# Altium project PCB_Project.PrjPcb
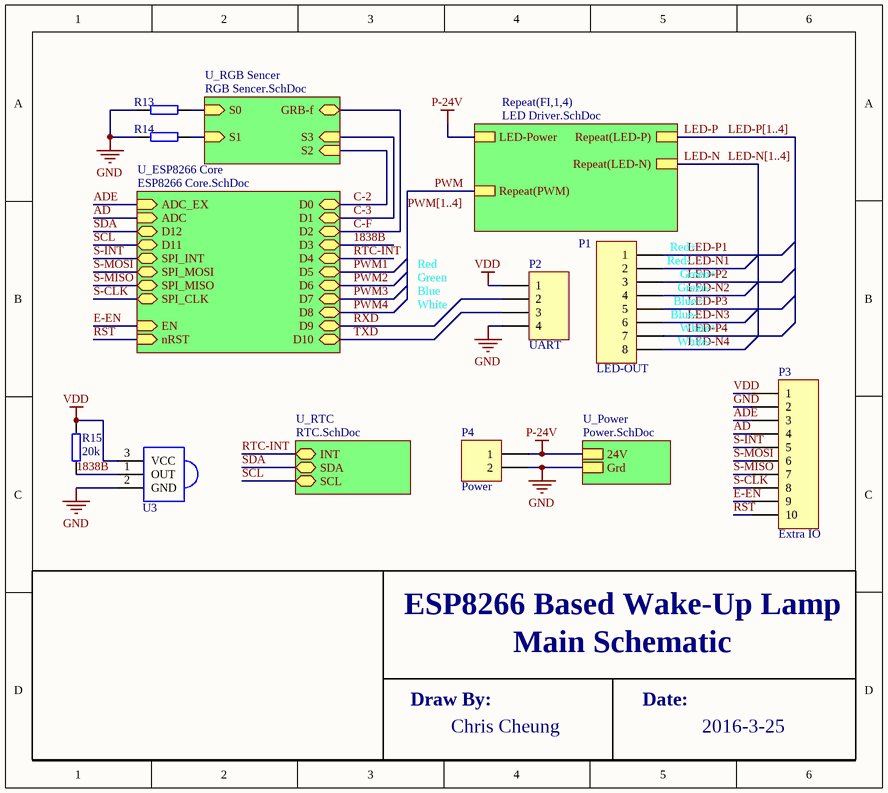
[diagram p0: Main.SchDoc]
6 sheets, 75 parts. Net scope: hierarchical (ports join the sheet entries above them; power ports are global).
Sheets:
  Main.SchDoc
    U_ESP8266 Core = ESP8266 Core.SchDoc
    U_Power = Power.SchDoc
    FI1 = LED Driver.SchDoc
    FI2 = LED Driver.SchDoc
    FI3 = LED Driver.SchDoc
    FI4 = LED Driver.SchDoc
    U_RGB Sencer = RGB Sencer.SchDoc
    U_RTC = RTC.SchDoc

## Sheet Main.SchDoc
size 165 x 147 mm

### Parts
P1  LED-OUT  [HDR1X8H]
P2  UART  [HDR1X4H]
P3  Extra IO  [HDR1X10H]
P4  Power  [HDR1X2]
R13  0Ohm  [SMT_R_0402]  (value not drawn)
R14  0Ohm  [SMT_R_0402]  (value not drawn)
R15  20k  [SMT_R_0402]
U3  Infrared In-VS1838  (value not drawn)

### Sub-sheets
Repeat(FI,1,4) = LED Driver.SchDoc: Repeat(LED-P), Repeat(LED-N), Repeat(PWM), LED-Power
U_ESP8266 Core = ESP8266 Core.SchDoc: D0 (bidir), D1 (bidir), D2 (bidir), D3 (bidir), D4 (bidir), D5 (bidir), D6 (bidir), D7 (bidir), D8 (bidir), D9 (bidir), D10 (bidir), D11 (bidir), D12 (bidir), SPI_INT (bidir), SPI_MOSI (bidir), SPI_MISO (bidir), SPI_CLK (bidir), nRST (in), ADC_EX (in), ADC (in), EN (in)
U_Power = Power.SchDoc: 24V, Grd
U_RGB Sencer = RGB Sencer.SchDoc: S0 (in), S1 (in), S2 (in), S3 (in), GRB-f (bidir)
U_RTC = RTC.SchDoc: INT (bidir), SDA (bidir), SCL (bidir)

### Nets
GND: P2.4 P3.2 P4.2 R13.1 R14.1 U3.2(GND) ; sheet U_Power/Grd
P-24V: P4.1 ; sheet U_Power/24V, sheet Repeat(FI,1,4)/LED-Power
VDD: P2.1 P3.1 R15.2 U3.3(VCC)
1838B: R15.1 U3.1(OUT) ; sheet U_ESP8266 Core/D3
AD: P3.4 ; sheet U_ESP8266 Core/ADC
ADE: P3.3 ; sheet U_ESP8266 Core/ADC_EX  [project net ADC_EX]
C-2: sheet U_ESP8266 Core/D0, sheet U_RGB Sencer/S2
C-3: sheet U_ESP8266 Core/D1, sheet U_RGB Sencer/S3
C-F: sheet U_ESP8266 Core/D2, sheet U_RGB Sencer/GRB-f
E-EN: P3.9 ; sheet U_ESP8266 Core/EN
LED-N: sheet Repeat(FI,1,4)/Repeat(LED-N)
LED-N1: P1.2
LED-N2: P1.4
LED-N3: P1.6
LED-N4: P1.8
LED-P: sheet Repeat(FI,1,4)/Repeat(LED-P)
LED-P1: P1.1
LED-P2: P1.3
LED-P3: P1.5
LED-P4: P1.7
PWM: sheet Repeat(FI,1,4)/Repeat(PWM)
RST: P3.10 ; sheet U_ESP8266 Core/nRST  [project net nRST]
RTC-INT: sheet U_ESP8266 Core/D4, sheet U_RTC/INT  [project net GPIO2]
RXD: P2.2 ; sheet U_ESP8266 Core/D9
S0: R13.2 ; sheet U_RGB Sencer/S0
S1: R14.2 ; sheet U_RGB Sencer/S1
S-CLK: P3.8 ; sheet U_ESP8266 Core/SPI_CLK
S-INT: P3.5 ; sheet U_ESP8266 Core/SPI_INT
S-MISO: P3.7 ; sheet U_ESP8266 Core/SPI_MISO
S-MOSI: P3.6 ; sheet U_ESP8266 Core/SPI_MOSI
SCL: sheet U_ESP8266 Core/D11, sheet U_RTC/SCL  [project net GPIO9]
SDA: sheet U_ESP8266 Core/D12, sheet U_RTC/SDA  [project net GPIO10]
TXD: P2.3 ; sheet U_ESP8266 Core/D10

### Buses and harness runs
bus LED-N[1..4]
bus LED-P[1..4]
bus PWM[1..4]

### Notes on the sheet
- Red
- (near P1) Red-
- (near P1) Red+
- (near P1) Green+
- Green
- Blue
- White
- (near P1) Blue-
- (near P1) Blue+
- (near P1) Green-
- (near P1) White+
- (near P1) White-
- ESP8266 Based Wake-Up Lamp
- Main Schematic
- Draw By:
- Chris Cheung
- Date:
- 2016-3-25

### Library data of the parts
P1 = Header 8H: Header, 8-Pin, Right Angle; LatestRevisionDate: 17-Jul-2002; LatestRevisionNote: Re-released for DXP Platform.; Publisher: Altium Limited
P2 = Header 4H: Header, 4-Pin, Right Angle; LatestRevisionDate: 17-Jul-2002; LatestRevisionNote: Re-released for DXP Platform.; Publisher: Altium Limited
P3 = Header 10H: Header, 10-Pin, Right Angle; LatestRevisionDate: 17-Jul-2002; LatestRevisionNote: Re-released for DXP Platform.; Publisher: Altium Limited
P4 = Header 2: Header, 2-Pin; LatestRevisionDate: 17-Jul-2002; LatestRevisionNote: Re-released for DXP Platform.; Publisher: Altium Limited
R13-R15 = SMT_R_0402: Surface mount resistor 0402
U3 = VS1838: Infrared In

## Sheet ESP8266 Core.SchDoc
size 165 x 190 mm
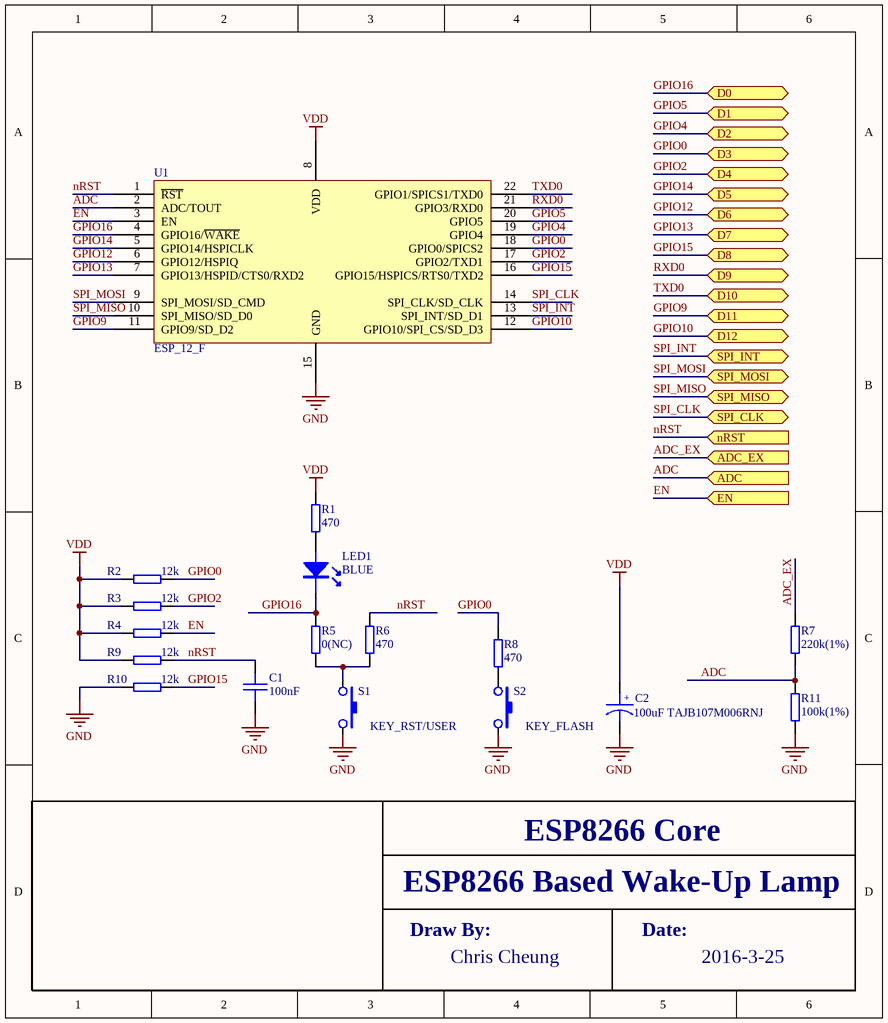
[diagram p1: ESP8266 Core.SchDoc]

### Parts
C1  100nF  [SMT_C_0402]
C2  100uF TAJB107M006RNJ  [SMT_C_Tantalum_B]
LED1  BLUE  [SMT_LED_0603]
R1  470  [SMT_R_0402]
R2  12k  [SMT_R_0402]
R3  12k  [SMT_R_0402]
R4  12k  [SMT_R_0402]
R5  0(NC)  [SMT_R_0402]
R6  470  [SMT_R_0402]
R7  220k(1%)  [SMT_R_0402]
R8  470  [SMT_R_0402]
R9  12k  [SMT_R_0402]
R10  12k  [SMT_R_0402]
R11  100k(1%)  [SMT_R_0402]
S1  KEY_RST/USER  [SMT_SW_PTS_820]
S2  KEY_FLASH  [SMT_SW_PTS_820]
U1  ESP_12_F  [ESP_12_E_L]

### Ports
ADC (in), ADC_EX (in), D0 (bidir), D1 (bidir), D2 (bidir), D3 (bidir), D4 (bidir), D5 (bidir), D6 (bidir), D7 (bidir), D8 (bidir), D9 (bidir), D10 (bidir), D11 (bidir), D12 (bidir), EN (in), nRST (in), SPI_CLK (bidir), SPI_INT (bidir), SPI_MISO (bidir), SPI_MOSI (bidir)

### Nets
GND: C1.2 C2.2 R10.1 R11.1 S1.2 S2.2 U1.15(GND)
VDD: C2.1 R1.2 R2.1 R3.1 R4.1 R9.1 U1.8(VDD)
ADC: R7.1 R11.2 U1.2(ADC/TOUT) ; port ADC  [project net AD]
ADC_EX: R7.2 ; port ADC_EX
EN: R4.2 U1.3(EN) ; port EN  [project net E-EN]
GPIO0: R2.2 R8.2 U1.18(GPIO0/SPICS2) ; port D3  [project net 1838B]
GPIO2: R3.2 U1.17(GPIO2/TXD1) ; port D4
GPIO4: U1.19(GPIO4) ; port D2  [project net C-F]
GPIO5: U1.20(GPIO5) ; port D1  [project net C-3]
GPIO9: U1.11(GPIO9/SD_D2) ; port D11
GPIO10: U1.12(GPIO10/SPI_CS/SD_D3) ; port D12
GPIO12: U1.6(GPIO12/HSPIQ) ; port D6
GPIO13: U1.7(GPIO13/HSPID/CTS0/RXD2) ; port D7
GPIO14: U1.5(GPIO14/HSPICLK) ; port D5
GPIO15: R10.2 U1.16(GPIO15/HSPICS/RTS0/TXD2) ; port D8
GPIO16: LED1.2(K) R5.2 U1.4(GPIO16/~{WAKE}) ; port D0  [project net C-2]
nRST: C1.1 R6.2 R9.2 U1.1(~{RST}) ; port nRST
RXD0: U1.21(GPIO3/RXD0) ; port D9  [project net RXD]
SPI_CLK: U1.14(SPI_CLK/SD_CLK) ; port SPI_CLK  [project net S-CLK]
SPI_INT: U1.13(SPI_INT/SD_D1) ; port SPI_INT  [project net S-INT]
SPI_MISO: U1.10(SPI_MISO/SD_D0) ; port SPI_MISO  [project net S-MISO]
SPI_MOSI: U1.9(SPI_MOSI/SD_CMD) ; port SPI_MOSI  [project net S-MOSI]
TXD0: U1.22(GPIO1/SPICS1/TXD0) ; port D10  [project net TXD]
NetLED1_1: LED1.1(A) R1.1
NetR5_1: R5.1 R6.1 S1.1
NetR8_1: R8.1 S2.1

### Notes on the sheet
- ESP8266 Based Wake-Up Lamp
- ESP8266 Core
- Draw By:
- Chris Cheung
- Date:
- 2016-3-25
- (in symbol SMT_C_Tantalum_B) +

### Library data of the parts
C1 = SMT_C_0402: Surface mount capacitor 0402
C2 = SMT_C_Tantalum_B: Capacitor, SM Tantalum; Body 3.5 x 2.8 mm (LxW typ)
LED1 = SMT_LED_0603: SMT LED
R1-R11 = SMT_R_0402: Surface mount resistor 0402
S1 S2 = SMT_SW_PTS_820: SMT Tactile ‎Switch PTS 820 Series
U1 = ESP_12_E: ESP-12 Wi-Fi Module by AI-Thinker; IC: ESP8266-EX; Vendor: Ai-thinker

## Sheet Power.SchDoc
size 165 x 127 mm
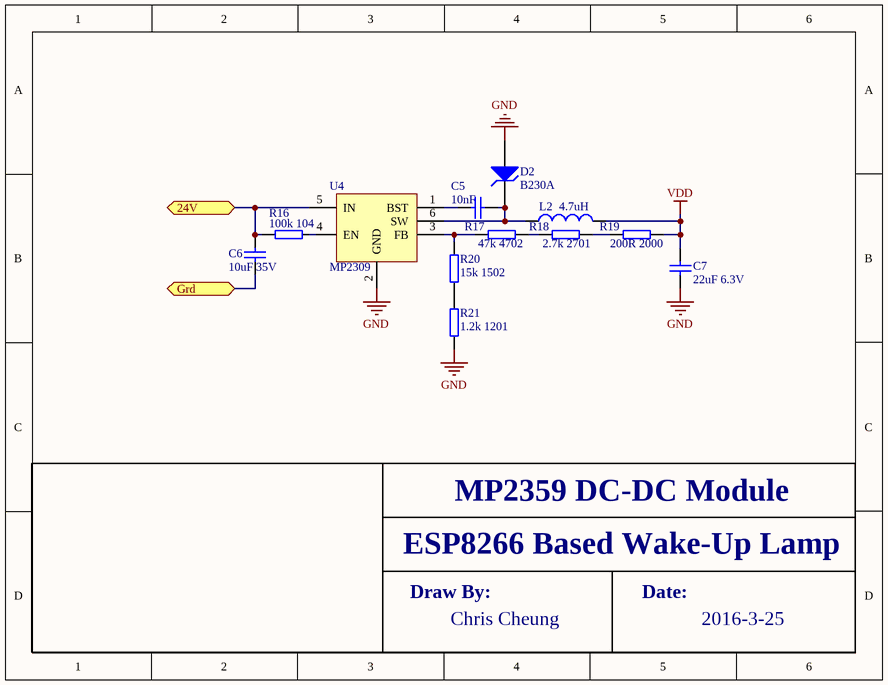
[diagram p2: Power.SchDoc]

### Parts
C5  value 10nF  [RAD-0.3]  (hidden comment: Cap)
C6  value 10uF 35V  [RAD-0.3]  (hidden comment: Cap)
C7  value 22uF 6.3V  [RAD-0.3]  (hidden comment: Cap)
D2  B230A  [DIODE-0.7]
L2  value 4.7uH  [0402-A]  (hidden comment: Inductor)
R16  100k 104  [SMT_R_0402]
R17  47k 4702  [SMT_R_0402]
R18  2.7k 2701  [SMT_R_0402]
R19  200R 2000  [SMT_R_0402]
R20  15k 1502  [SMT_R_0402]
R21  1.2k 1201  [SMT_R_0402]
U4  MP2309

### Ports
24V, Grd

### Nets
GND: C6.1 C7.1 D2.1(A) R21.1 U4.2(GND) ; port Grd
P-24V: C6.2 R16.1 U4.5(IN) ; port 24V
VDD: C7.2 L2.2 R19.2
NetC5_1: C5.1 D2.2(K) L2.1 U4.6(SW)
NetC5_2: C5.2 U4.1(BST)
NetR16_2: R16.2 U4.4(EN)
NetR17_1: R17.1 R20.2 U4.3(FB)
NetR17_2: R17.2 R18.1
NetR18_2: R18.2 R19.1
NetR20_1: R20.1 R21.2

### Notes on the sheet
- MP2359 DC-DC Module
- ESP8266 Based Wake-Up Lamp
- Draw By:
- Chris Cheung
- Date:
- 2016-3-25

### Library data of the parts
C5-C7 = Cap: Capacitor; Published: 8-Jun-2000; LatestRevisionDate: 17-Jul-2002; LatestRevisionNote: Re-released for DXP Platform.; PackageReference: RAD-0.3; Publisher: Altium Limited; PackageDescription: Radial Cap, Thru-Hole; 2 Leads; 0.3 in Pin Spacing
D2 = D Zener: Zener Diode; Published: 8-Jun-2000; LatestRevisionDate: 17-Jul-2002; LatestRevisionNote: Re-released for DXP Platform.; PackageReference: DIODE-0.7; Publisher: Altium Limited; PackageDescription: Diode, Thru-Hole; 2 Leads; 0.7 in Pin Spacing
L2 = Inductor: Code_IEC: 1005; Published: 8-Jun-2000; LatestRevisionDate: 29-May-2009; LatestRevisionNote: IPC-7351 Footprint Added.; PackageReference: 0402-A; Publisher: Altium Limited; PackageDescription: Chip Inductor; Code_JEITA: 0402
R16-R21 = SMT_R_0402: Surface mount resistor 0402

## Sheet LED Driver.SchDoc
size 165 x 165 mm; Author: Chris Cheung
Used 4 times, as channels FI1, FI2, FI3, FI4. Parts and nets are listed once, with the designators drawn on the sheet.
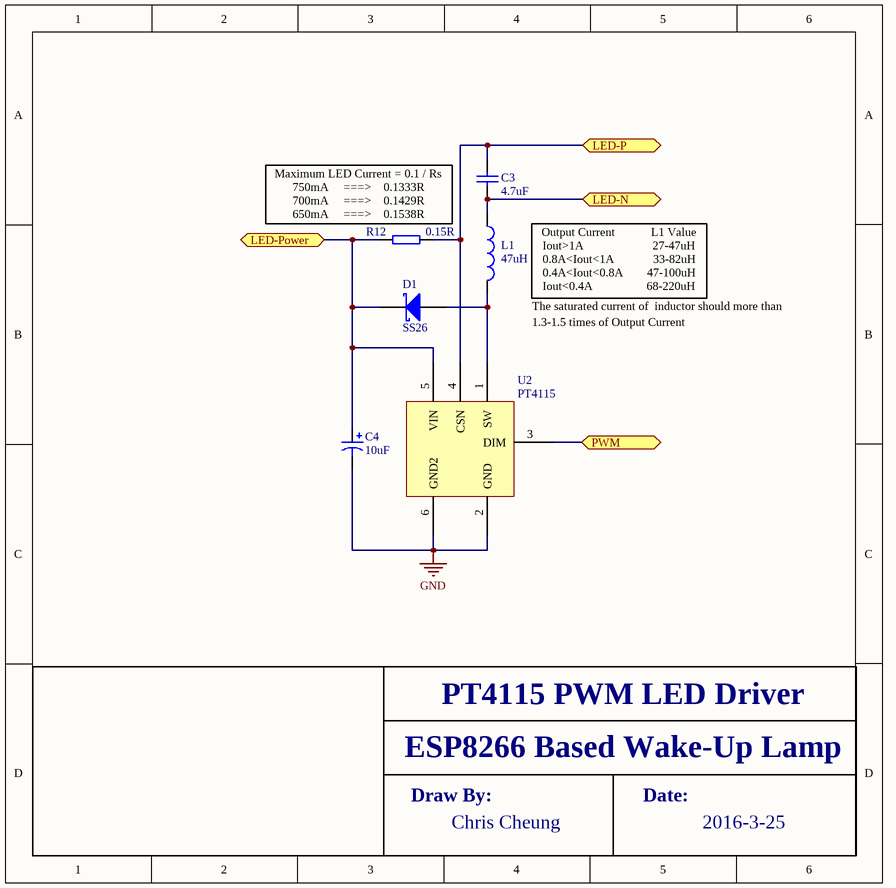
[diagram p3: LED Driver.SchDoc]

### Parts
C3  value 4.7uF  [RAD-0.3]  (hidden comment: Cap)
C4  value 10uF  [C0805]  (hidden comment: Cap Pol3)
D1  SS26  [DO-204AL]
L1  value 47uH  [0402-A]  (hidden comment: Inductor)
R12  0.15R  [SMT_R_0402]
U2  PT4115

### Ports
LED-N, LED-P, LED-Power, PWM

### Nets
GND: C4.2 U2.2(GND) U2.6(GND2)
LED-N: C3.1 L1.1 ; port LED-N
LED-P: C3.2 R12.2 U2.4(CSN) ; port LED-P
LED-Power: C4.1 D1.2(K) R12.1 U2.5(VIN) ; port LED-Power
PWM: U2.3(DIM) ; port PWM
NetD1_1: D1.1(A) L1.2 U2.1(SW)

### Channels
FI1: designators end in A; ports LED-N=LED-N1 LED-P=LED-P1 LED-Power=P-24V PWM=GPIO14
FI2: designators end in B; ports LED-N=LED-N2 LED-P=LED-P2 LED-Power=P-24V PWM=GPIO12
FI3: designators end in C; ports LED-N=LED-N3 LED-P=LED-P3 LED-Power=P-24V PWM=GPIO13
FI4: designators end in D; ports LED-N=LED-N4 LED-P=LED-P4 LED-Power=P-24V PWM=GPIO15

### Notes on the sheet
- (near R12) Maximum LED Current = 0.1 / Rs
  750mA     ===>    0.1333R
  700mA     ===>    0.1429R
  650mA     ===>    0.1538R
- Output Current            L1 Value
  Iout>1A                       27-47uH
  0.8A<Iout<1A             33-82uH
  0.4A<Iout<0.8A        47-100uH
  Iout<0.4A                  68-220uH
- (near L1) The saturated current of  inductor should more than
- 1.3-1.5 times of Output Current
- PT4115 PWM LED Driver
- ESP8266 Based Wake-Up Lamp
- Draw By:
- Chris Cheung
- Date:
- 2016-3-25

### Library data of the parts
C3 = Cap: Capacitor; Published: 8-Jun-2000; LatestRevisionDate: 17-Jul-2002; LatestRevisionNote: Re-released for DXP Platform.; PackageReference: RAD-0.3; Publisher: Altium Limited; PackageDescription: Radial Cap, Thru-Hole; 2 Leads; 0.3 in Pin Spacing
C4 = Cap Pol3: Polarized Capacitor (Surface Mount); Published: 8-Jun-2000; LatestRevisionDate: 29-May-2009; LatestRevisionNote: IPC-7351 Footprint Added.; PackageReference: C0805; Publisher: Altium Limited; PackageDescription: Chip Capacitor
D1 = Diode 11DQ03: Schottky Rectifier; Published: 8-Jun-2000; LatestRevisionDate: 17-Jul-2002; LatestRevisionNote: Re-released for DXP Platform.; DatasheetVersion: Dec-1997; PackageReference: DO-204AL; Publisher: Altium Limited; PackageDescription: Diode, Axial; Body 5.2 x 2.7 mm (LxDia. max), Lead Dia. 0.86 mm (max); Code_JEDEC: DO-204-AL; ComponentLink1Description: Manufacturer Link; ComponentLink1URL: http://www.irf.com/; ComponentLink2Description: Datasheet; ComponentLink2URL: http://www.irf.com/product-info/datasheets/data/11dq03.pdf
L1 = Inductor: Code_IEC: 1005; Published: 8-Jun-2000; LatestRevisionDate: 29-May-2009; LatestRevisionNote: IPC-7351 Footprint Added.; PackageReference: 0402-A; Publisher: Altium Limited; PackageDescription: Chip Inductor; Code_JEITA: 0402
R12 = SMT_R_0402: Surface mount resistor 0402
U2 = PT4115: LED Driver

## Sheet RGB Sencer.SchDoc
size 165 x 127 mm
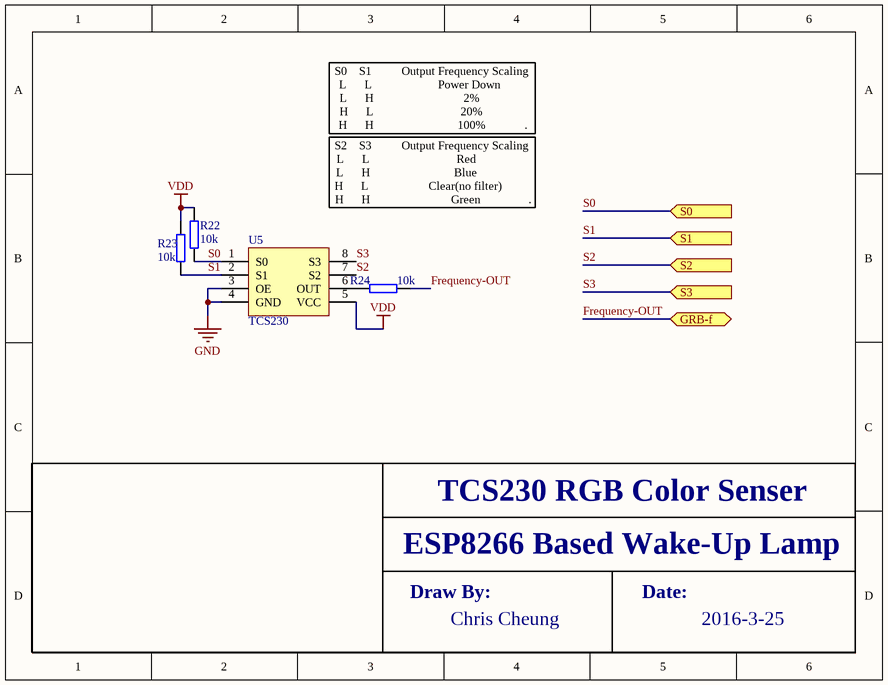
[diagram p4: RGB Sencer.SchDoc]

### Parts
R22  10k  [SMT_R_0402]
R23  10k  [SMT_R_0402]
R24  10k  [SMT_R_0402]
U5  value TCS230  [SO-8]  (hidden comment: Color sensor)

### Ports
GRB-f (bidir), S0 (in), S1 (in), S2 (in), S3 (in)

### Nets
GND: U5.3(OE) U5.4(GND)
VDD: R22.2 R23.2 U5.5(VCC)
Frequency-OUT: R24.2 ; port GRB-f  [project net C-F]
S0: R22.1 U5.1(S0) ; port S0
S1: R23.1 U5.2(S1) ; port S1
S2: U5.7(S2) ; port S2  [project net C-2]
S3: U5.8(S3) ; port S3  [project net C-3]
NetR24_1: R24.1 U5.6(OUT)

### Notes on the sheet
- S0    S1          Output Frequency Scaling
  L      L                      Power Down
  L      H                              2%
  H      L                             20%
  H      H                            100%             .
- S2    S3          Output Frequency Scaling
  L      L                             Red
  L      H                            Blue
  H      L                    Clear(no filter)
  H      H                           Green                .
- TCS230 RGB Color Senser
- ESP8266 Based Wake-Up Lamp
- Draw By:
- Chris Cheung
- Date:
- 2016-3-25

### Library data of the parts
R22-R24 = SMT_R_0402: Surface mount resistor 0402
U5 = TCS230

## Sheet RTC.SchDoc
size 165 x 127 mm
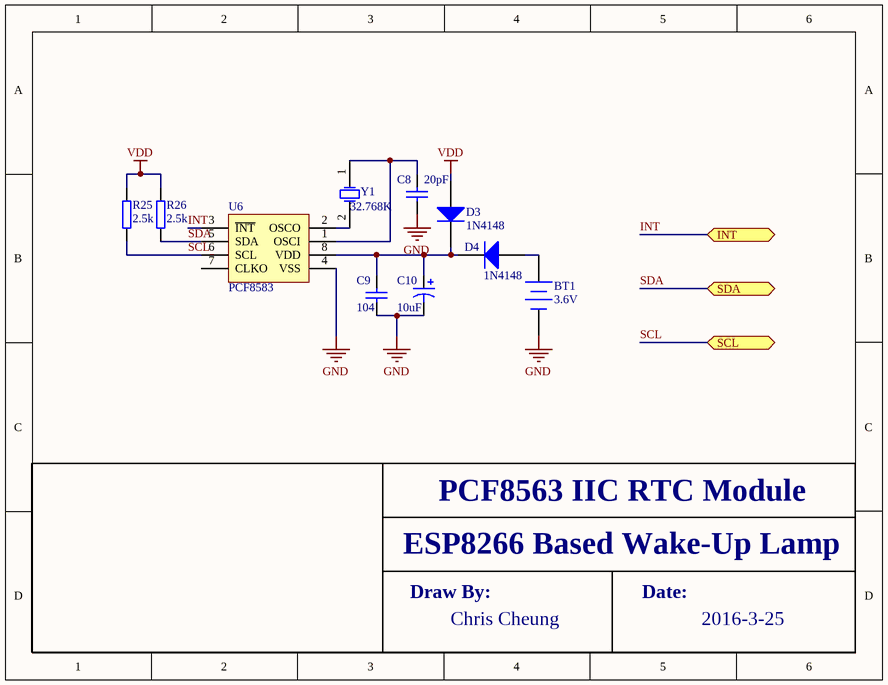
[diagram p5: RTC.SchDoc]

### Parts
BT1  3.6V  [BAT-2]
C8  value 20pF  [RAD-0.3]  (hidden comment: Cap)
C9  value 104  [RAD-0.3]  (hidden comment: Cap)
C10  value 10uF  [C0805]  (hidden comment: Cap Pol3)
D3  1N4148  [DO-41]
D4  1N4148  [DO-41]
R25  2.5k  [SMT_R_0402]
R26  2.5k  [SMT_R_0402]
U6  value PCF8583  (hidden comment: Real Time)
Y1  value 32.768K  [R38]  (hidden comment: SMD)

### Ports
INT (bidir), SCL (bidir), SDA (bidir)

### Nets
GND: BT1.2(-) C8.1 C9.1 C10.2 U6.4(VSS)
VDD: D3.1(A) R25.2 R26.2
INT: U6.3(~{INT}) ; port INT  [project net GPIO2]
SCL: R25.1 U6.6(SCL) ; port SCL  [project net GPIO9]
SDA: R26.1 U6.5(SDA) ; port SDA  [project net GPIO10]
NetBT1_1: BT1.1(+) D4.1(A)
NetC8_2: C8.2 U6.1(OSCI) Y1.1(OSC1)
NetC9_2: C9.2 C10.1 D3.2(K) D4.2(K) U6.8(VDD)
NetU6_2: U6.2(OSCO) Y1.2(OSC2)

Not connected (* = marked no-connect by the designer): U6 7(CLKO)

### Notes on the sheet
- PCF8563 IIC RTC Module
- ESP8266 Based Wake-Up Lamp
- Draw By:
- Chris Cheung
- Date:
- 2016-3-25

### Library data of the parts
BT1 = Battery: Multicell Battery; Published: 24-Mar-1999; LatestRevisionDate: 17-Jul-2002; LatestRevisionNote: Re-released for DXP Platform.; PackageReference: BAT-2; Publisher: Altium Limited; PackageDescription: Battery; 2 Leads
C8 C9 = Cap: Capacitor; Published: 8-Jun-2000; LatestRevisionDate: 17-Jul-2002; LatestRevisionNote: Re-released for DXP Platform.; PackageReference: RAD-0.3; Publisher: Altium Limited; PackageDescription: Radial Cap, Thru-Hole; 2 Leads; 0.3 in Pin Spacing
C10 = Cap Pol3: Polarized Capacitor (Surface Mount); Published: 8-Jun-2000; LatestRevisionDate: 29-May-2009; LatestRevisionNote: IPC-7351 Footprint Added.; PackageReference: C0805; Publisher: Altium Limited; PackageDescription: Chip Capacitor
D3 D4 = Diode 1N4001: 1 Amp General Purpose Rectifier; Published: 8-Jun-2000; LatestRevisionDate: 17-Jul-2002; LatestRevisionNote: Re-released for DXP Platform.; DatasheetVersion: 1998; PackageVersion: Aug-1999; PackageReference: DO-41; Publisher: Altium Limited; PackageDescription: Diode, Axial; Body 5.2 x 2.7 mm (LxDia. max), Lead Dia. 0.86 mm (max); Code_JEDEC: DO-204-AL; ComponentLink1Description: Manufacturer Link; ComponentLink1URL: http://www.fairchildsemi.com/; ComponentLink2Description: Datasheet; ComponentLink2URL: http://www.fairchildsemi.com/ds/1N%2F1N4001.pdf
R25 R26 = SMT_R_0402: Surface mount resistor 0402
U6 = PCF8583
Y1 = XTAL: Crystal Oscillator; Published: 8-Jun-2000; LatestRevisionDate: 17-Jul-2002; LatestRevisionNote: Re-released for DXP Platform.; PackageReference: R38; Publisher: Altium Limited; PackageDescription: Crystal, Thru-Hole; 2 Leads; Body 3.1 x 8.2 mm (Dia.xH)

## Nets that join several sheets
GND: Main (6 pins), ESP8266 Core (7 pins), Power (5 pins), FI1 (C4A.2 U2A.2 U2A.6), FI2 (C4B.2 U2B.2 U2B.6), FI3 (C4C.2 U2C.2 U2C.6), FI4 (C4D.2 U2D.2 U2D.6), RGB Sencer (U5.3 U5.4), RTC (5 pins)
P-24V: Main (P4.1), Power (C6.2 R16.1 U4.5), FI1 (C4A.1 D1A.2 R12A.1 U2A.5), FI2 (C4B.1 D1B.2 R12B.1 U2B.5), FI3 (C4C.1 D1C.2 R12C.1 U2C.5), FI4 (C4D.1 D1D.2 R12D.1 U2D.5)
VDD: Main (P2.1 P3.1 R15.2 U3.3), ESP8266 Core (7 pins), Power (C7.2 L2.2 R19.2), RGB Sencer (R22.2 R23.2 U5.5), RTC (D3.1 R25.2 R26.2)
1838B: Main (R15.1 U3.1), ESP8266 Core (R2.2 R8.2 U1.18)
AD: Main (P3.4), ESP8266 Core (R7.1 R11.2 U1.2)
ADC_EX: Main (P3.3), ESP8266 Core (R7.2)
C-2: ESP8266 Core (LED1.2 R5.2 U1.4), RGB Sencer (U5.7)
C-3: ESP8266 Core (U1.20), RGB Sencer (U5.8)
C-F: ESP8266 Core (U1.19), RGB Sencer (R24.2)
E-EN: Main (P3.9), ESP8266 Core (R4.2 U1.3)
GPIO2: ESP8266 Core (R3.2 U1.17), RTC (U6.3)
GPIO9: ESP8266 Core (U1.11), RTC (R25.1 U6.6)
GPIO10: ESP8266 Core (U1.12), RTC (R26.1 U6.5)
GPIO12: ESP8266 Core (U1.6), FI2 (U2B.3)
GPIO13: ESP8266 Core (U1.7), FI3 (U2C.3)
GPIO14: ESP8266 Core (U1.5), FI1 (U2A.3)
GPIO15: ESP8266 Core (R10.2 U1.16), FI4 (U2D.3)
LED-N1: Main (P1.2), FI1 (C3A.1 L1A.1)
LED-N2: Main (P1.4), FI2 (C3B.1 L1B.1)
LED-N3: Main (P1.6), FI3 (C3C.1 L1C.1)
LED-N4: Main (P1.8), FI4 (C3D.1 L1D.1)
LED-P1: Main (P1.1), FI1 (C3A.2 R12A.2 U2A.4)
LED-P2: Main (P1.3), FI2 (C3B.2 R12B.2 U2B.4)
LED-P3: Main (P1.5), FI3 (C3C.2 R12C.2 U2C.4)
LED-P4: Main (P1.7), FI4 (C3D.2 R12D.2 U2D.4)
nRST: Main (P3.10), ESP8266 Core (C1.1 R6.2 R9.2 U1.1)
RXD: Main (P2.2), ESP8266 Core (U1.21)
S0: Main (R13.2), RGB Sencer (R22.1 U5.1)
S1: Main (R14.2), RGB Sencer (R23.1 U5.2)
S-CLK: Main (P3.8), ESP8266 Core (U1.14)
S-INT: Main (P3.5), ESP8266 Core (U1.13)
S-MISO: Main (P3.7), ESP8266 Core (U1.10)
S-MOSI: Main (P3.6), ESP8266 Core (U1.9)
TXD: Main (P2.3), ESP8266 Core (U1.22)